# Altium schematic sheet TempCtrl.SchDoc
size A3; DrawnBy: Sergej; Organization: ElektronikLabor; SheetNumber: 4; SheetName: Over Temperature Protection; DocumentName: Temperature Protection
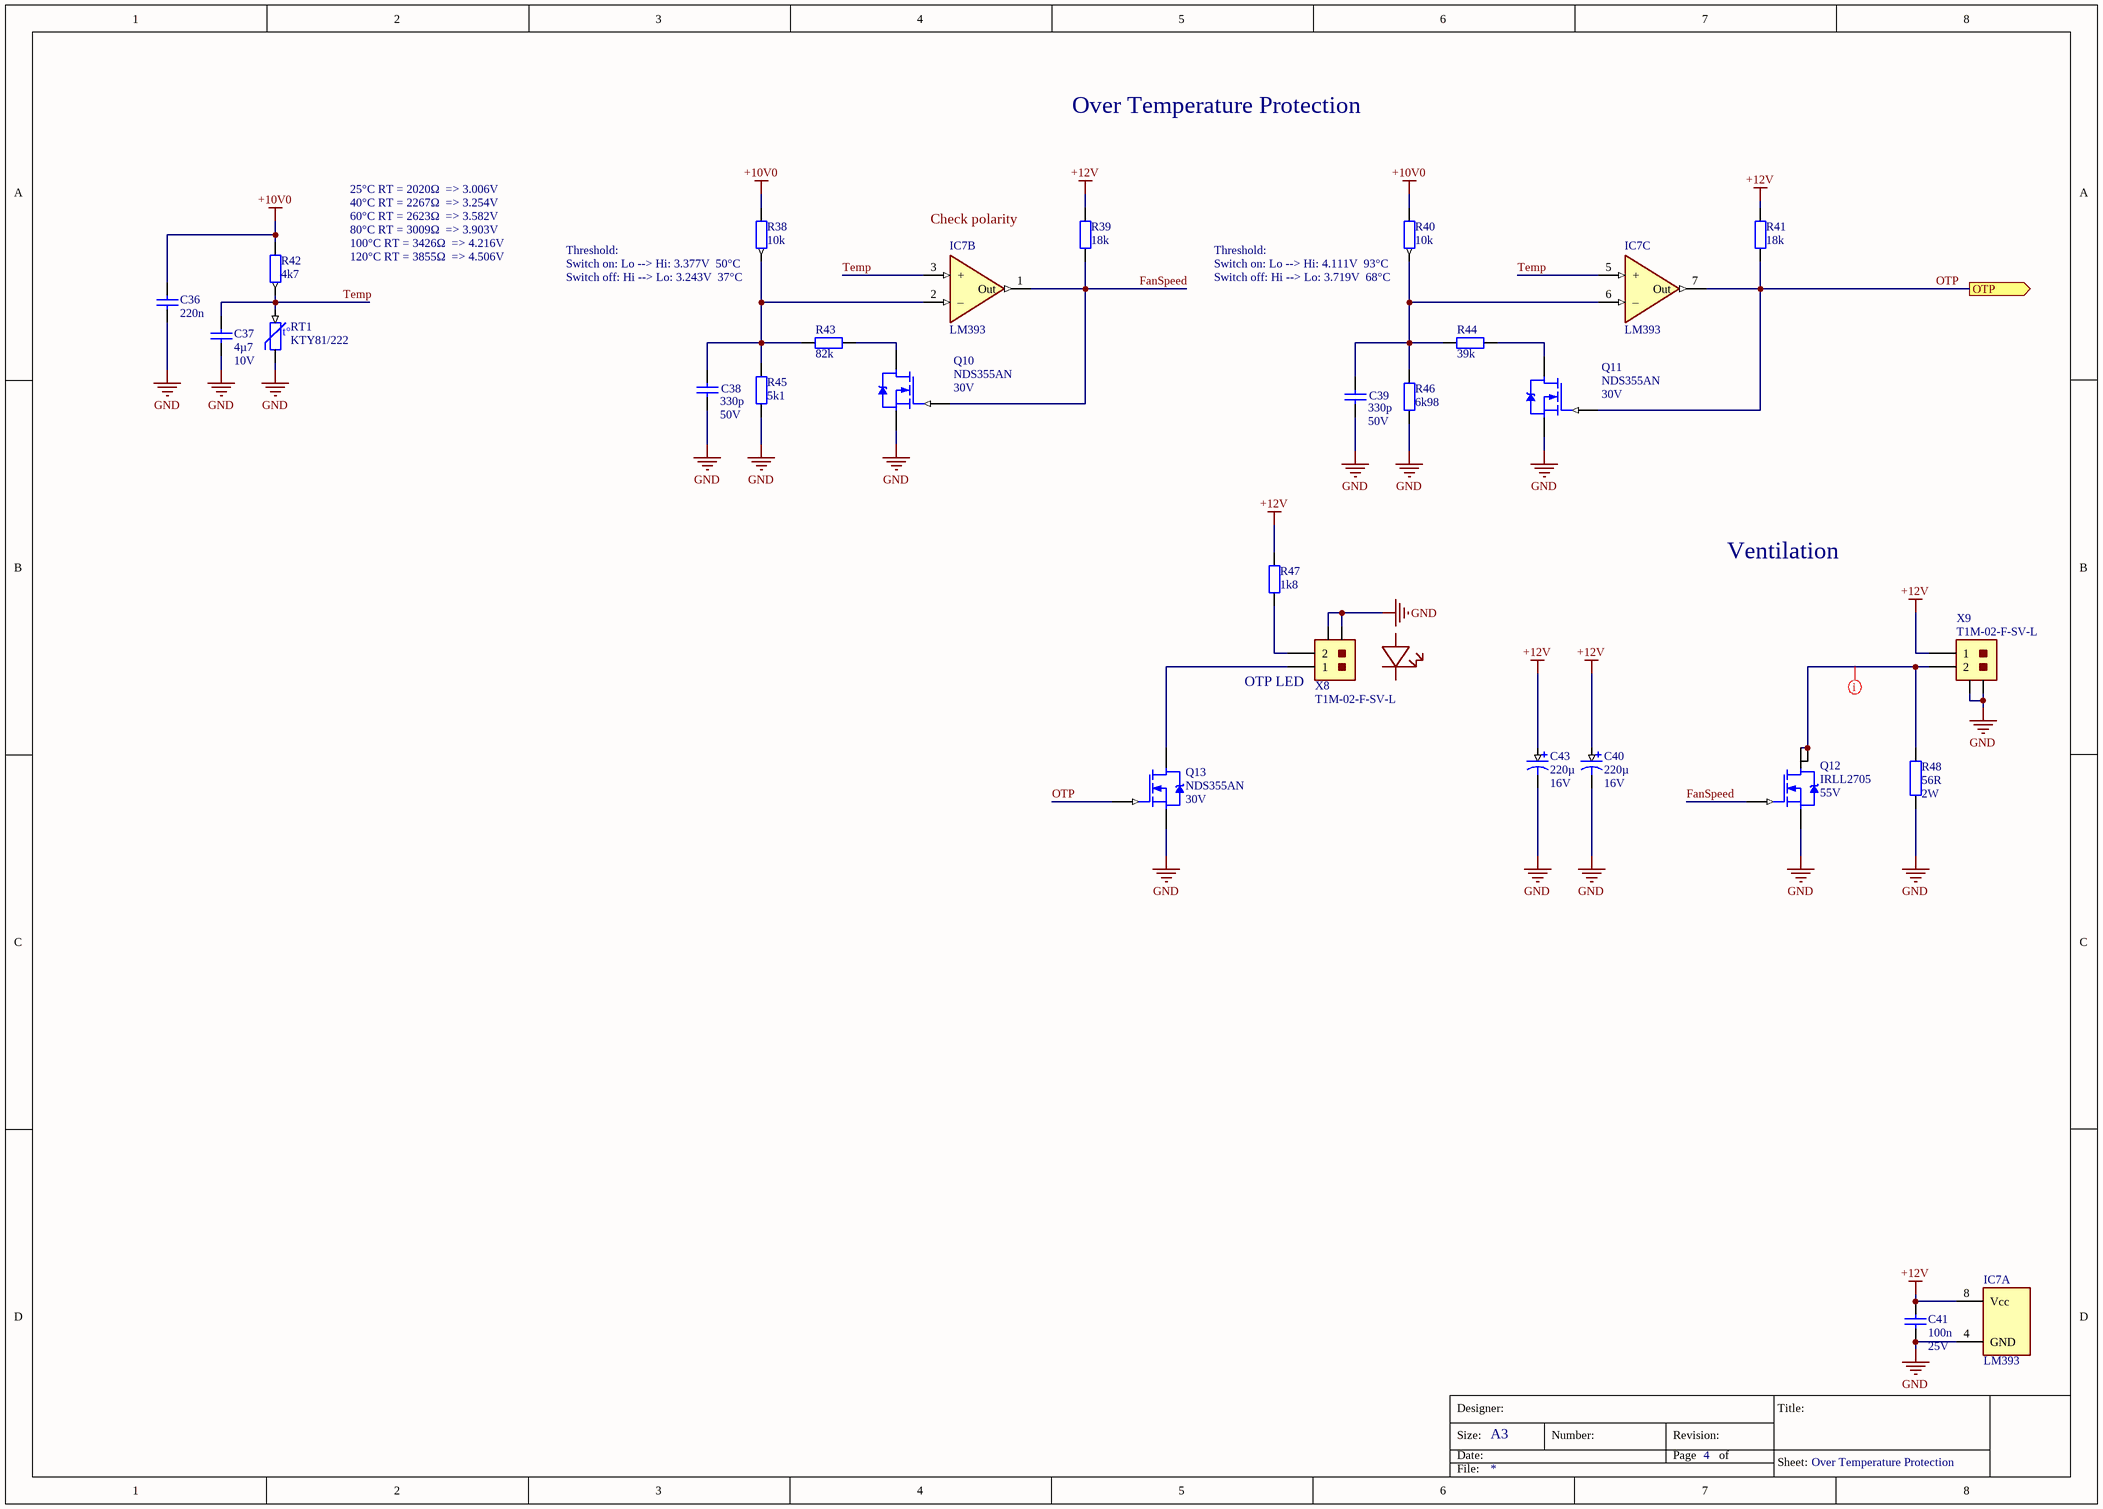
[diagram p0: TempCtrl.SchDoc]

## Parts
C36  220n  [C_0805]
C37  4µ7  Voltage: 10V  [C_0805]
C38  330p  Voltage: 50V  [C_0805]
C39  330p  Voltage: 50V  [C_0805]
C40  220µ  Voltage: 16V  [Cap Tantal E (2917)]
C41  100n  Voltage: 25V  [C_0805]
C43  220µ  Voltage: 16V  [Cap Tantal E (2917)]
IC7  LM393  [SOIC8_N]  (parts A,B,C of 3)
Q10  NDS355AN  Voltage: 30V  [SOT23_N - n-MOS]
Q11  NDS355AN  Voltage: 30V  [SOT23_N - n-MOS]
Q12  IRLL2705  Voltage: 55V  [SOT-223]
Q13  NDS355AN  Voltage: 30V  [SOT23_N - n-MOS]
R38  10k  [Res 0805]
R39  18k  [Res 0805]
R40  10k  [Res 0805]
R41  18k  [Res 0805]
R42  4k7  [Res 0805]
R43  82k  [Res 0805]
R44  39k  [Res 0805]
R45  5k1  [Res 0805]
R46  6k98  [Res 0805]
R47  1k8  [Res 0805]
R48  56R  Power: 2W  [RES PO593-0 vert]
RT1  KTY81/222  [TO-92-2]
X8  T1M-02-F-SV-L  [T1M-02-XX-S-V]
X9  T1M-02-F-SV-L  [T1M-02-XX-S-V]

## Ports
OTP (out)

## Nets
+10V0: C36.1 R38.1 R40.1 R42.1
+12V: C40.1 C41.1 C43.1 IC7.8(Vcc) R39.1 R41.1 R47.1 X9.1
GND: C36.2 C37.2 C38.2 C39.2 C40.2 C41.2 C43.2 IC7.4(GND) Q10.2(S) Q11.2(S) Q12.3(S) Q13.2(S) R45.2 R46.2 R48.2 RT1.1 X8.3(CASE) X8.4(CASE) X9.3(CASE) X9.4(CASE)
FanSpeed: IC7.1(Out) Q10.1(G) Q12.1(G) R39.2
OTP: IC7.7(Out) Q11.1(G) Q13.1(G) R41.2 ; port OTP
Temp: C37.1 IC7.3(+) IC7.5(+) R42.2 RT1.2
NetC38_1: C38.1 IC7.2(–) R38.2 R43.1 R45.1
NetC39_1: C39.1 IC7.6(–) R40.2 R44.1 R46.1
NetQ10_3: Q10.3(D) R43.2
NetQ11_3: Q11.3(D) R44.2
NetQ12_2: Q12.2(D) Q12.4(D) R48.1 X9.2
NetQ13_3: Q13.3(D) X8.1
NetR47_2: R47.2 X8.2

## Layout directives
rule Width Constraint [Pref Width = 2mm    Min Width = 1mm    Max Width = 2mm]: NetQ12_2

## Notes on the sheet
- Over Temperature Protection
- Check polarity
- 25°C	RT = 2020Ω  => 3.006V
  40°C	RT = 2267Ω  => 3.254V
  60°C	RT = 2623Ω  => 3.582V
  80°C	RT = 3009Ω  => 3.903V
  100°C	RT = 3426Ω  => 4.216V
  120°C	RT = 3855Ω  => 4.506V
- (near R38) Threshold:
  Switch on: Lo --> Hi: 3.377V  50°C
  Switch off: Hi --> Lo: 3.243V  37°C
- (near R40) Threshold:
  Switch on: Lo --> Hi: 4.111V  93°C
  Switch off: Hi --> Lo: 3.719V  68°C
- Ventilation
- (near X8) OTP LED
- Size:
- Date:
- Designer:
- A3
- Number:
- Revision:
- Page
- of
- Title:
- File:
- Sheet:
- (in symbol KTY81/222) t°

## Library data of the parts
C36 = C-Cer 0805 220n: Cap Ceramic 0805 220n 50V; Manufacturer: generic; Temp. Coeff.: X7R; PackageReference: C0805; PackageDescription: Chip Capacitor; Value: 220n; PartNumber: generic; Voltage: 50V
C37 = C-Cer 0805 4µ7: Cap Ceramic 0805 4µ7 10V; Manufacturer: generic; Temp. Coeff.: X5R; PackageReference: C0805; PackageDescription: Chip Capacitor; Value: 4µ7; PartNumber: generic
C38 C39 = C-Cer 0805 330p: Cap Ceramic 0805 330p 50V; Manufacturer: generic; Temp. Coeff.: X7R; PackageReference: C0805; PackageDescription: Chip Capacitor; Value: 330p; PartNumber: generic; Price [€]: 0,18
C40 C43 = Cap Tantal 220µ: Cap Tantal 220µ 16V SMD; Manufacturer: AVX; PartNumber: TPSE227*016#0100; Value: 220µ; ComponentLink1Description: Datasheet; ComponentLink1URL: G:\Daten\Datenblätter\Kondensatoren\AVX_Tantal_TPS.pdf; Supplier Part Number 1: TPS 7343 220/16; Supplier 1: Reichelt; Price [€]: 1,15
C41 = C-Cer 0805 100n: Cap Ceramic 0805 100n 25V; Manufacturer: generic; Temp. Coeff.: X7R; PackageReference: C_0805; PackageDescription: Chip Capacitor; Value: 100n; PartNumber: generic
IC7 = LM393DT: Comparator LM393DT 2x; Manufacturer: ST; Manufacturer_B: ROHM; Value: LM393; PartNumber: LM393DT; Price [€]: 0,44; ComponentLink1Description: Datasheet; ComponentLink1URL: G:\Daten\Datenblätter\Komparatoren\ST_LM393.pdf; Supplier 1: Digi-Key; Supplier Part Number 1: 497-1593-1-ND; PartNumber_B: LM393DT
Q10 Q11 Q13 = Transistor n-MOS NDS355AN: Transistor n-MOS SOT-23 30V Vgs=20V; Manufacturer: ON Semiconductor; Note: Vgs_max = 20V; Current: 1.7A; PackageDescription: SOT-23; ComponentLink1Description: Datasheet; ComponentLink1URL: G:\Daten\Datenblätter\Transistoren\nMOS_NDS355AN.pdf; PartNumber: NDS355AN; Supplier 1: Digi-Key; Supplier Part Number 1: NDS355ANCT-ND; Price [€]: 0,39
Q12 = Transistor n-MOS IRLL2705: Transistor n-MOS SOT-223 55V Vgs=16V; Manufacturer: International Rectifier; PartNumber: IRLL2705PbF; Note: Vgs_max = 16V; Current: 3.8A; PackageDescription: SOT-223; ComponentLink1Description: Datasheet; ComponentLink1URL: G:\Daten\Datenblätter\Transistoren\nMOS_IRLL2705.pdf; Price [€]: 0,44; Supplier 1: Reichelt; Supplier Part Number 1: IRLL 2705; Value: IRLL2705; ComponentLink2URL: https://www.reichelt.de/IRL-IRFZ-Transistoren/IRLL-2705/3/index.html?ACTION=3&GROUPID=2896&ARTICLE=129817&OFFSET=75&; ComponentLink2Description: Supplier
R38 R40 = Res 0805 10k: Resistor 0805 10k; Manufacturer: generic; Power: 0.125W; PartNumber: generic; Value: 10k
R39 R41 = Res 0805 18k: Resistor 0805 18k; Manufacturer: generic; Power: 0.125W; PartNumber: generic; Value: 18k
R42 = Res 0805 4k7: Resistor 0805 4k7; Manufacturer: generic; Power: 0.125W; PartNumber: generic; Value: 4k7
R43 = Res 0805 82k: Resistor 0805 82k; Manufacturer: generic; Power: 0.125W; PartNumber: generic; Value: 82k
R44 = Res 0805 39k: Resistor 0805 39k; Manufacturer: generic; Power: 0.125W; PartNumber: generic; Value: 39k
R45 = Res 0805 5k1: Resistor 0805 5k1; Manufacturer: generic; Power: 0.125W; PartNumber: generic; Value: 5k1
R46 = Res 0805 6k98: Resistor 0805 6k98; Manufacturer: generic; Power: 0.125W; PartNumber: generic; Value: 6k98
R47 = Res 0805 1k8: Resistor 0805 1k8; Manufacturer: generic; Power: 0.125W; PartNumber: generic; Value: 1k8
R48 = Res Power 56R: Resistor 56R 2W THT; Manufacturer: VITROHM; PartNumber: PO593-0 5 T 56R; Value: 56R; ComponentLink1URL: G:\Daten\Datenblätter\Widerstände\VITROHM_series_PO.pdf; ComponentLink1Description: Datasheet; ComponentLink2URL: https://www.reichelt.de/2W-Metall-1-0-Ohm-820-Ohm/2W-METALL-56/3/index.html?ACTION=3&GROUPID=3083&ARTICLE=2359&OFFSET=75&; ComponentLink2Description: Supplier; Supplier Part Number 1: 2W METALL 56; Supplier 1: Reichelt; Price [€]: 0,11
RT1 = KTY81/222: Sensor Temp 2k TO92-2; Manufacturer: NXP; PartNumber: KTY81/222; Value: 2k; ComponentLink1URL: G:\Daten\Datenblätter\Sensoren\KTY81.pdf; ComponentLink1Description: Datasheet; Supplier Part Number 1: 181048 - 62; Supplier 1: Conrad; Price [€]: 2,05; Package: TO92-2
X8 X9 = Con Male 2-Pin: Connector, Male, Vertical, 2-Pin, 1mm, SMD; Manufacturer: SAMTEC; MatingPartNumber: S1SS-02-L; PartNumber: T1M-02-F-SV-L; Value: T1M-02-F-SV-L; Supplier Part Number 1: T1M-02-F-SV-L; Supplier 1: SAMTEC; ComponentLink1Description: Datasheet; ComponentLink1URL: G:\Daten\Datenblätter\Steckverbinder\T1M-Single-Row.pdf